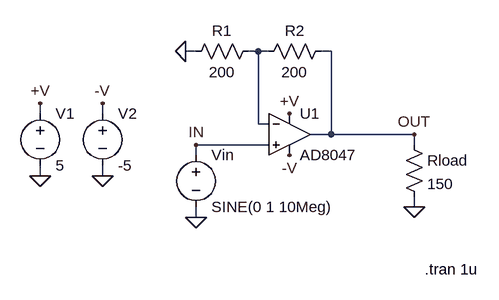
[diagram p0: schematic AD8047.asc]
AD8047.asc, the LTspice schematic file:
Version 4
SHEET 1 1432 700
WIRE 560 -1184 544 -1184
WIRE 656 -1184 640 -1184
WIRE 672 -1184 656 -1184
WIRE 768 -1184 752 -1184
WIRE 320 -1088 320 -1104
WIRE 416 -1088 416 -1104
WIRE 656 -1072 656 -1184
WIRE 672 -1072 656 -1072
WIRE 768 -1056 768 -1184
WIRE 768 -1056 736 -1056
WIRE 896 -1056 768 -1056
WIRE 672 -1040 560 -1040
WIRE 896 -1040 896 -1056
WIRE 560 -1024 560 -1040
WIRE 320 -992 320 -1008
WIRE 416 -992 416 -1008
WIRE 896 -944 896 -960
WIRE 560 -928 560 -944
FLAG 560 -928 0
FLAG 896 -1056 OUT
FLAG 560 -1040 IN
FLAG 704 -1088 +V
FLAG 704 -1024 -V
FLAG 544 -1184 0
FLAG 896 -944 0
FLAG 320 -1104 +V
FLAG 320 -992 0
FLAG 416 -1104 -V
FLAG 416 -992 0
SYMBOL res 656 -1200 R90
WINDOW 0 0 56 VBottom 2
WINDOW 3 32 56 VTop 2
SYMATTR InstName R1
SYMATTR Value 200
SYMBOL res 768 -1200 R90
WINDOW 0 0 56 VBottom 2
WINDOW 3 32 56 VTop 2
SYMATTR InstName R2
SYMATTR Value 200
SYMBOL Opamps\\AD8047 704 -1120 R0
SYMATTR InstName U1
SYMBOL res 880 -1056 R0
SYMATTR InstName Rload
SYMATTR Value 150
SYMBOL voltage 560 -1040 R0
WINDOW 123 24 146 Left 2
WINDOW 39 24 125 Left 2
SYMATTR InstName Vin
SYMATTR Value SINE(0 1 10Meg)
SYMBOL voltage 320 -1104 R0
WINDOW 123 0 0 Left 2
WINDOW 39 0 0 Left 2
SYMATTR InstName V1
SYMATTR Value 5
SYMBOL voltage 416 -1104 R0
WINDOW 123 24 146 Left 2
WINDOW 39 24 125 Left 2
SYMATTR InstName V2
SYMATTR Value -5
TEXT 912 -848 Left 2 !.tran 1u

The netlist it stands for:
* AD8047.asc
R1 N001 0 200
R2 OUT N001 200
XU1 IN N001 +V -V OUT AD8047  ; pins In+ In- V+ V- OUT
Rload OUT 0 150
Vin IN 0 SINE(0 1 10Meg)
V1 +V 0 5
V2 -V 0 -5
.tran 1u
.backanno
.end